# Altium schematic sheet KitPic18.SchDoc
size A
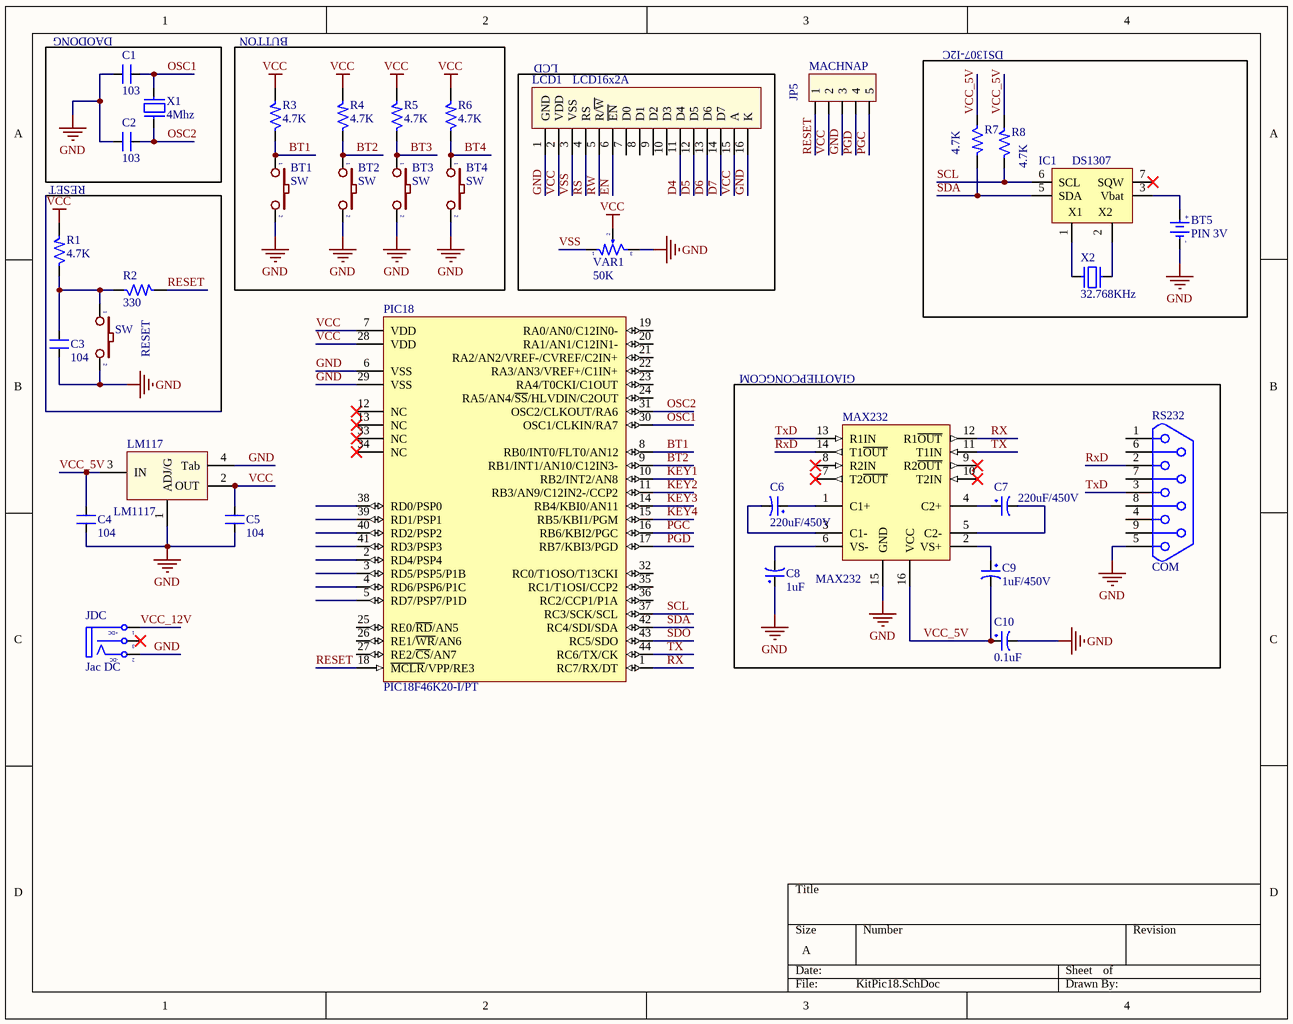
[diagram p0: KitPic18.SchDoc]

## Parts
BT1  SW  [SW2]
BT2  SW  [SW2]
BT3  SW  [SW2]
BT4  SW  [SW2]
BT5  PIN 3V  [PIN 3V-S]
C1  103  [SM-0805]
C2  103  [SM-0805]
C3  104  [SM-0805]
C4  104  [SM-0805]
C5  104  [SM-0805]
C6  220uF/450V  [CP4.5/19]
C7  220uF/450V  [CP4.5/19]
C8  1uF  [CP4.5/19]
C9  1uF/450V  [CP4.5/19]
C10  0.1uF  [CP4.5/19]
IC1  DS1307  [DIP8/W0.3]
JDC  Jac DC  [DC-IN]
LCD1  LCD16x2A  [LCD16X2]
LM117  LM1117  [SOT223-4N]
MACHNAP  JP5  [CON5]
MAX232  MAX232  [DIP16/W0.3]
PIC18  PIC18F46K20-I/PT  [TQFP-PT44_N]
R1  4.7K  [R1/4W]
R2  330  [R1/4W]
R3  4.7K  [R1/4W]
R4  4.7K  [R1/4W]
R5  4.7K  [R1/4W]
R6  4.7K  [R1/4W]
R7  4.7K  [R1/4W]
R8  4.7K  [R1/4W]
RESET  SW  [SW2]
RS232  COM  [DSB 9-M]
VAR1  50K  [VOL-S]
X1  4Mhz  [XT2]
X2  32.768KHz  [XT2]

## Blocks framed on the sheet
BUTTON: BT1-BT4 R3-R6
LCD: LCD1 VAR1
DS1307-I2C: BT5 IC1 R7 R8 X2
GIAOTIEPCONGCOM: C6-C10 MAX232 RS232

## Nets
GND: BT1.2 BT2.2 BT3.2 BT4.2 BT5.2(GND) C1.1 C2.1 C3.1 C4.1 C5.1 C8.1 C10.2 IC1.4(GND) JDC.2(TN) LCD1.1(GND) LCD1.16(K) LM117.1(ADJ/G) LM117.4(Tab) MACHNAP.3 MAX232.15(GND) PIC18.6(VSS) PIC18.29(VSS) RESET.2 RS232.5 VAR1.3
VCC: C5.2 IC1.8(VCC) LCD1.2(VDD) LCD1.15(A) LM117.2(OUT) MACHNAP.2 PIC18.7(VDD) PIC18.28(VDD) R1.2 R3.2 R4.2 R5.2 R6.2 VAR1.2
BT1: BT1.1 PIC18.8(RB0/INT0/FLT0/AN12) R3.1
BT2: BT2.1 PIC18.9(RB1/INT1/AN10/C12IN3-) R4.1
BT3: BT3.1 R5.1
BT4: BT4.1 R6.1
D4: LCD1.11(D4)
D5: LCD1.12(D5)
D6: LCD1.13(D6)
D7: LCD1.14(D7)
EN: LCD1.6(~{EN})
KEY1: PIC18.10(RB2/INT2/AN8)
KEY2: PIC18.11(RB3/AN9/C12IN2-/CCP2)
KEY3: PIC18.14(RB4/KBI0/AN11)
KEY4: PIC18.15(RB5/KBI1/PGM)
OSC1: C1.2 PIC18.30(OSC1/CLKIN/RA7) X1.2
OSC2: C2.2 PIC18.31(OSC2/CLKOUT/RA6) X1.1
PGC: MACHNAP.5 PIC18.16(RB6/KBI2/PGC)
PGD: MACHNAP.4 PIC18.17(RB7/KBI3/PGD)
RESET: MACHNAP.1 PIC18.18(~{MCLR}/VPP/RE3) R2.2
RS: LCD1.4(RS)
RW: LCD1.5(R/~{W})
RX: MAX232.12(R1~{OUT}) PIC18.1(RC7/RX/DT)
RxD: MAX232.14(T1~{OUT}) RS232.2
SCL: IC1.6(SCL) PIC18.37(RC3/SCK/SCL) R8.1
SDA: IC1.5(SDA) PIC18.42(RC4/SDI/SDA) R7.2
SDO: PIC18.43(RC5/SDO)
TX: MAX232.11(T1IN) PIC18.44(RC6/TX/CK)
TxD: MAX232.13(R1IN) RS232.3
VCC_5V: C4.2 C9.2 C10.1 LM117.3(IN) MAX232.16(VCC) R7.1 R8.2
VCC_12V: JDC.1(T)
VSS: LCD1.3(VSS) VAR1.1
NetBT5_1: BT5.1(+3V) IC1.3(Vbat)
NetC3_2: C3.2 R1.1 R2.1 RESET.1
NetC6_1: C6.1 MAX232.1(C1+)
NetC6_2: C6.2 MAX232.3(C1-)
NetC7_1: C7.1 MAX232.4(C2+)
NetC7_2: C7.2 MAX232.5(C2-)
NetC8_2: C8.2 MAX232.6(VS-)
NetC9_1: C9.1 MAX232.2(VS+)
NetIC1_1: IC1.1(X1) X2.1
NetIC1_2: IC1.2(X2) X2.2

Not connected (* = marked no-connect by the designer): IC1 7(SQW)*; JDC 3(S)*; LCD1 7(D0) 8(D1) 9(D2) 10(D3); MAX232 7(T2~{OUT})* 8(R2IN)* 9(R2~{OUT})* 10(T2IN)*; PIC18 2(RD4/PSP4) 3(RD5/PSP5/P1B) 4(RD6/PSP6/P1C) 5(RD7/PSP7/P1D) 12(NC)* 13(NC)* 19(RA0/AN0/C12IN0-) 20(RA1/AN1/C12IN1-) 21(RA2/AN2/VREF-/CVREF/C2IN+) 22(RA3/AN3/VREF+/C1IN+) 23(RA4/T0CKI/C1OUT) 24(RA5/AN4/~{SS}/HLVDIN/C2OUT) 25(RE0/~{RD}/AN5) 26(RE1/~{WR}/AN6) 27(RE2/~{CS}/AN7) 32(RC0/T1OSO/T13CKI) 33(NC)* 34(NC)* 35(RC1/T1OSI/CCP2) 36(RC2/CCP1/P1A) 38(RD0/PSP0) 39(RD1/PSP1) 40(RD2/PSP2) 41(RD3/PSP3); RS232 1 4 6 7 8 9

## Notes on the sheet
- (near C1) DAODONG
- RESET
- (in symbol DCIN) +DC; -DC
- (in symbol PIN 3V) +; -

## Library data of the parts
BT1-BT4 RESET = SW2: Switch button 2 pin; Value: SW chip 2 pin
BT5 = PIN 3V: Battery 3VDC; Value: PIN 3V
C1 C2 = CM: Cap SMD; Value: 103
C3-C5 = CM: Cap SMD; Value: 103
C6 C7 = CP9: Cap 10000uF/63V; Value: 220uF/450V
C8-C10 = CP9: Cap 10000uF/63V; Value: 220uF/450V
IC1 = DS1307: Real Timer Serial; Value: DS1307
JDC = DCIN: Jac DC input; Value: Jac DC
LCD1 = LCD16x2: LCD dipslay 16 char, 2 line; Value: LCD16x2A
LM117 = LM1117: 3v3; Value: LM317
MACHNAP = Con5: Connector 5; Value: Connector 5
MAX232 = MAX232: Dual EIA-232 Driver/Receiver; Value: MAX232
PIC18 = PIC18F46K20-I/PT: Flash Microcontroller with 10-Bit A/D and nanoWatt Technology, 32K Flash, 44-Pin TQFP, Industrial Temperature Range; Published: 2-Dec-2009; DatasheetVersion: revF, Sep-2009; PackageVersion: revBB, Aug-2009; PackageReference: TQFP-PT44; Publisher: Altium Limited; PackageDescription: 44-Lead Plastic Thin Quad Flatpack (PT) - 10x10x1mm Body, 2.00mm [TQFP]; Supplier 1: Digi-Key; Supplier Part Number 1: PIC18F46K20-I/PT-ND; Supplier 2: Farnell; Supplier Part Number 2: 1439591; Code_JEDEC: MS-026; ComponentLink1Description: Datasheet; ComponentLink1URL: http://ww1.microchip.com/downloads/en/DeviceDoc/41303F.pdf; ComponentLink2Description: Packaging Specification; ComponentLink2URL: http://www.microchip.com/stellent/groups/techpub_sg/documents/packagingspec/en012702.pdf; ComponentLink3Description: Microchip.com Home; ComponentLink3URL: http://www.microchip.com/
R1-R8 = R: Resistor 1/4W; Value: R1/4W - 1K
VAR1 = VOL-S: Var Resistor; Value: Volume 50k
X1 = XT2: Crystal For all Crystal 2pin.; Value: 4Mhz
X2 = XT2: Crystal For all Crystal 2pin.; Value: 4Mhz